# Altium schematic sheet 02_modify_note.SchDoc
size 297 x 209 mm
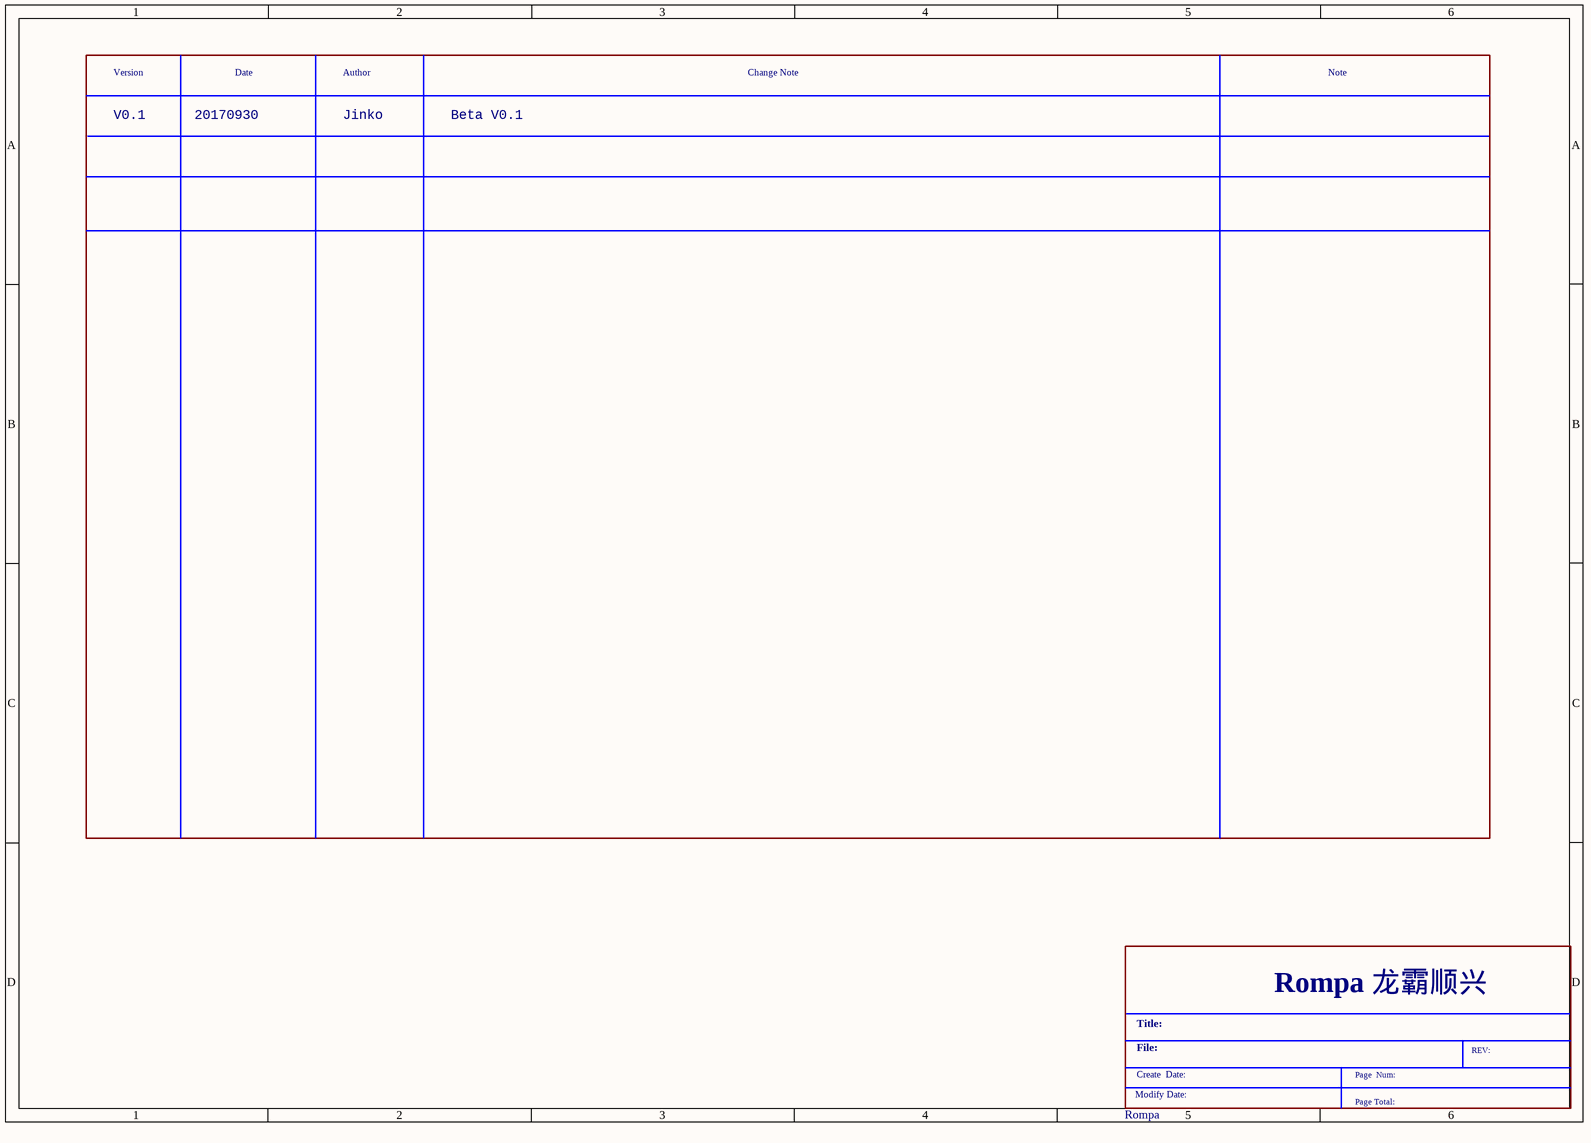
[diagram p0: 02_modify_note.SchDoc]

## Parts
*  Rompa  (graphical)

## Notes on the sheet
- Version
- V0.1
- 20170930
- Date
- Author
- Jinko
- Beta V0.1
- Change Note
- Note
- (in symbol Rompa) Rompa 龙霸顺兴; Title:; File:; REV:; Create  Date:; Page  Num:; Modify Date:; Page Total: